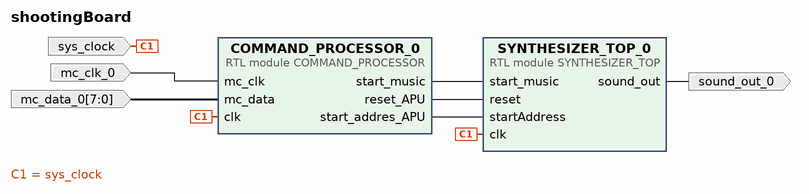
[diagram p0: block diagram of the top level]
# Vivado block design shootingBoard, xc7a35tcpg236-1, Vivado 2017.4
create_bd_design shootingBoard

create_bd_port -dir I -type clk sys_clock
set_property -dict {CONFIG.FREQ_HZ 100000000 CONFIG.PHASE 0.000} [get_bd_ports sys_clock]
create_bd_port -dir O sound_out_0
create_bd_port -dir I -type clk mc_clk_0
create_bd_port -dir I -from 7 -to 0 mc_data_0

create_bd_cell -type module -reference SYNTHESIZER_TOP SYNTHESIZER_TOP_0
create_bd_cell -type module -reference COMMAND_PROCESSOR COMMAND_PROCESSOR_0

# ---- connections ----

connect_bd_net [get_bd_pins COMMAND_PROCESSOR_0/start_music] [get_bd_pins SYNTHESIZER_TOP_0/start_music]
connect_bd_net [get_bd_pins COMMAND_PROCESSOR_0/reset_APU] [get_bd_pins SYNTHESIZER_TOP_0/reset]
connect_bd_net [get_bd_pins COMMAND_PROCESSOR_0/start_addres_APU] [get_bd_pins SYNTHESIZER_TOP_0/startAddress]
connect_bd_net -net clk_wiz_0_clk_out1 [get_bd_ports sys_clock] [get_bd_pins SYNTHESIZER_TOP_0/clk] [get_bd_pins COMMAND_PROCESSOR_0/clk]
connect_bd_net [get_bd_pins SYNTHESIZER_TOP_0/sound_out] [get_bd_ports sound_out_0]
connect_bd_net -net mc_clk_0_1 [get_bd_ports mc_clk_0] [get_bd_pins COMMAND_PROCESSOR_0/mc_clk]
connect_bd_net -net mc_data_0_1 [get_bd_ports mc_data_0] [get_bd_pins COMMAND_PROCESSOR_0/mc_data]

validate_bd_design
save_bd_design
